# EAGLE design mixer_board_smd (EAGLE 9.4.1)
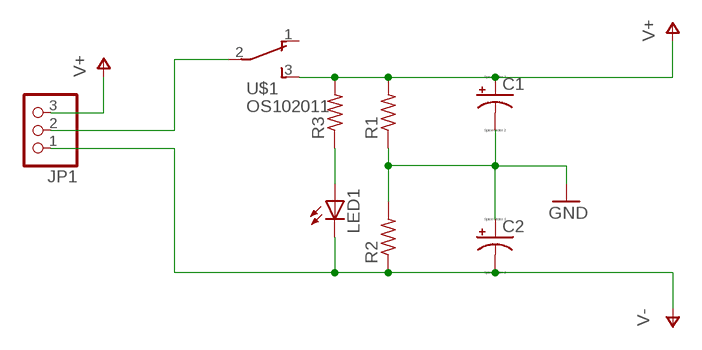
[diagram p0: schematic, sheet 1, part 1 of 2]
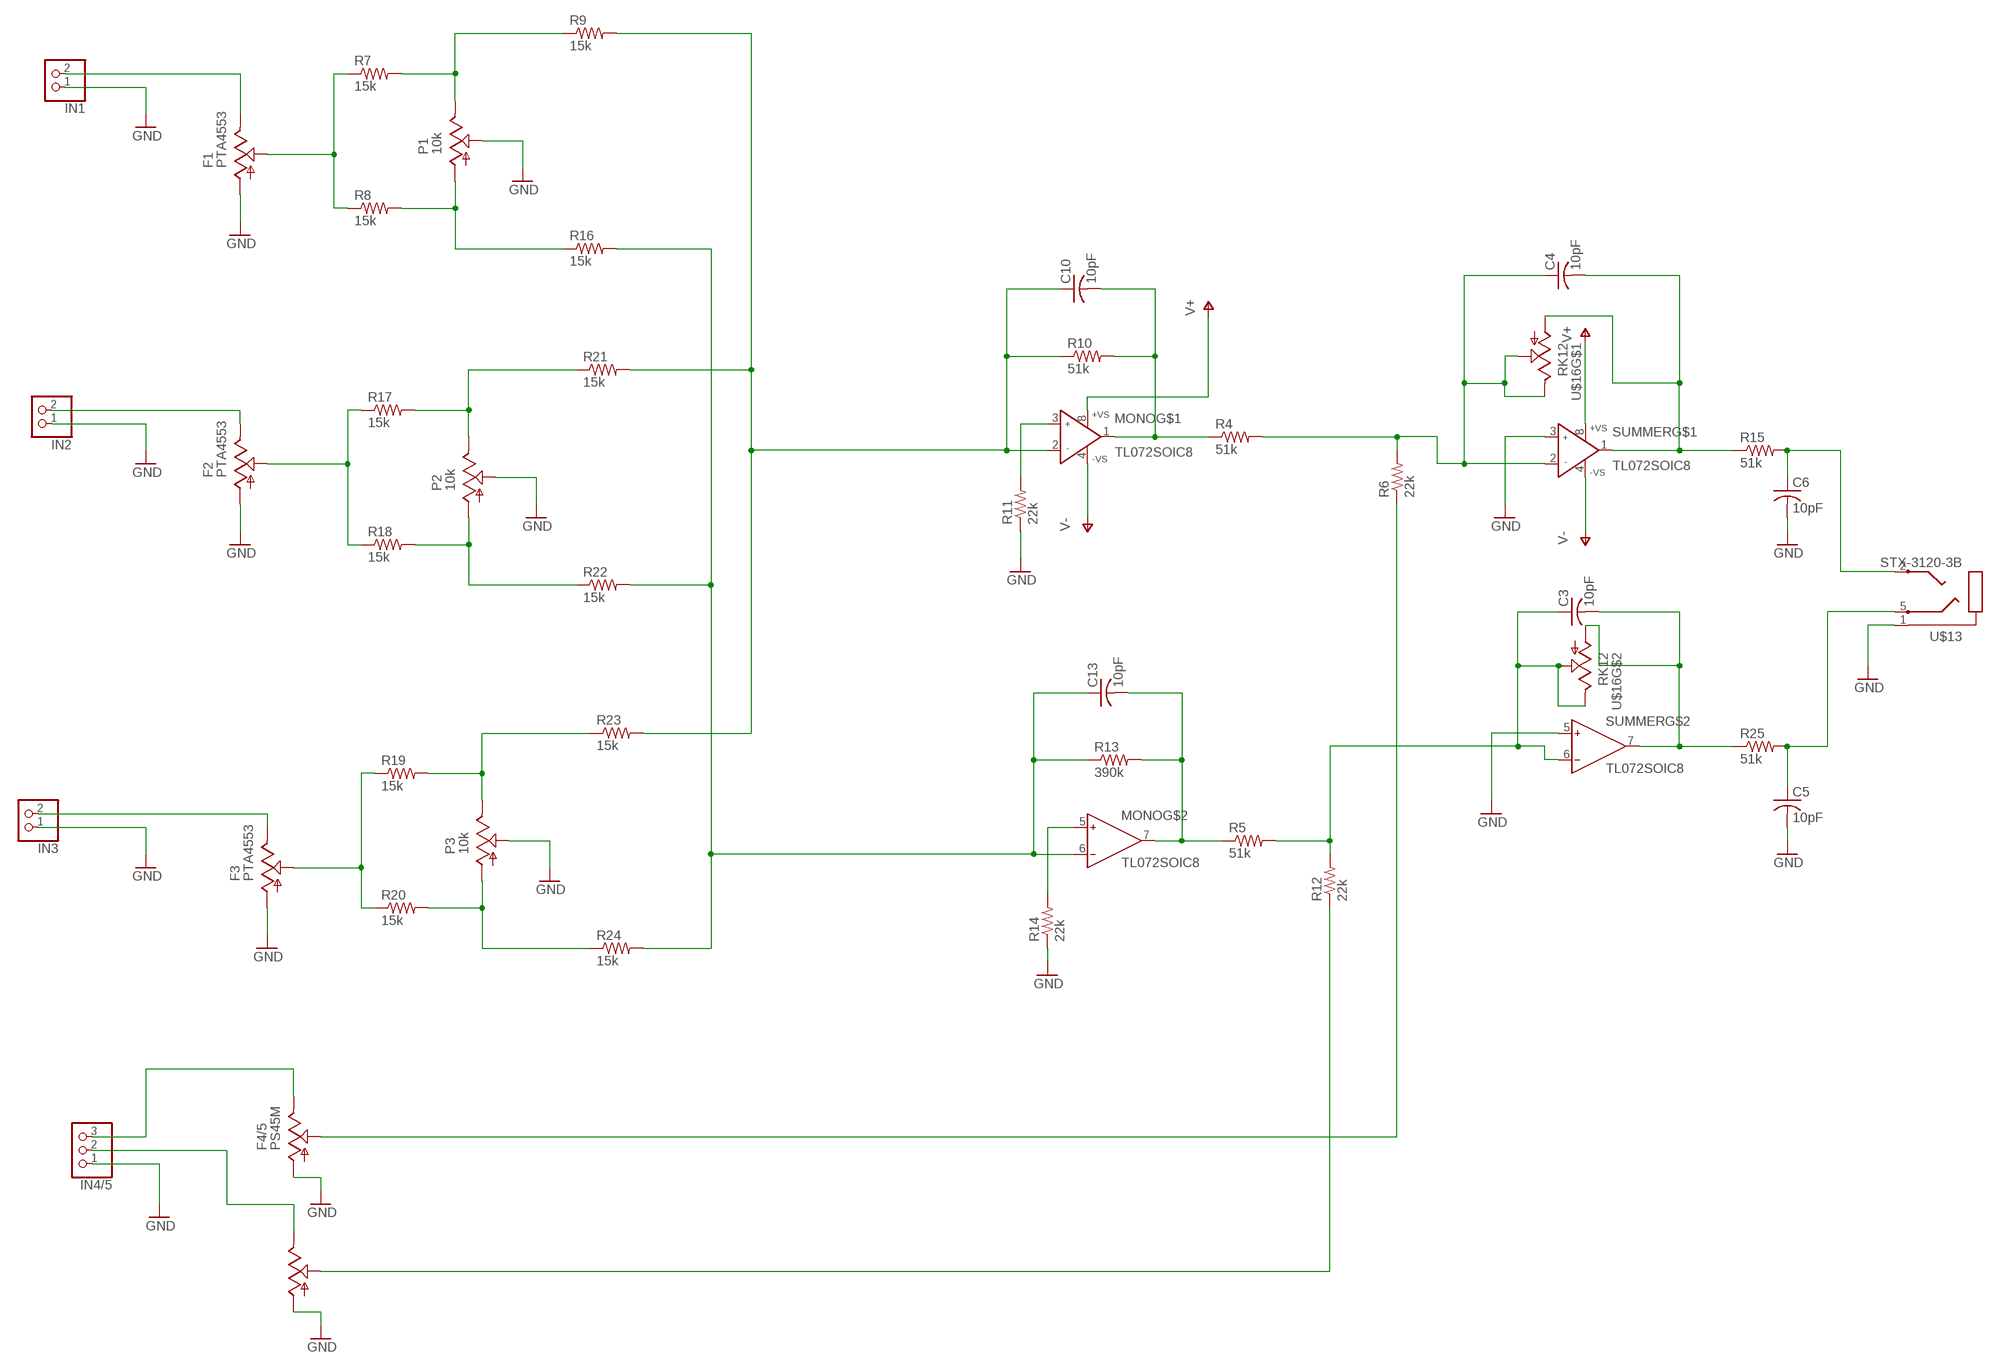
[diagram p1: schematic, sheet 1, part 2 of 2]

## Parts
C1  CPOL-USE1.8-4  [E1,8-4]
C2  CPOL-USE1.8-4  [E1,8-4]
C3  10pF  C-USC0805  [C0805]
C4  10pF  C-USC0805  [C0805]
C5  10pF  C-USC0805  [C0805]
C6  10pF  C-USC0805  [C0805]
C10  10pF  C-USC0805  [C0805]
C13  10pF  C-USC0805  [C0805]
F1  PTA4553  [PTA4553]
F2  PTA4553  [PTA4553]
F3  PTA4553  [PTA4553]
F4/5  PS45M  [PS45M]
IN1  PINHD-1X2/90  [1X02/90]
IN2  PINHD-1X2/90  [1X02/90]
IN3  PINHD-1X2/90  [1X02/90]
IN4/5  PINHD-1X3/90  [1X03/90]
JP1  PINHD-1X3/90  [1X03/90]
LED1  LEDCHIPLED_1206  [CHIPLED_1206]
MONO  TL072SOIC8  [SOIC8]
P1  10k  PTV09A  [PTV09A]
P2  10k  PTV09A  [PTV09A]
P3  10k  PTV09A  [PTV09A]
R1  R-US_M0805  [M0805]
R2  R-US_M0805  [M0805]
R3  R-US_R0805  [R0805]
R4  51k  R-US_M0805  [M0805]
R5  51k  R-US_M0805  [M0805]
R6  22k  R-US_M0805  [M0805]
R7  15k  R-US_M0805  [M0805]
R8  15k  R-US_M0805  [M0805]
R9  15k  R-US_M0805  [M0805]
R10  51k  R-US_M0805  [M0805]
R11  22k  R-US_M0805  [M0805]
R12  22k  R-US_M0805  [M0805]
R13  390k  R-US_M0805  [M0805]
R14  22k  R-US_M0805  [M0805]
R15  51k  R-US_M0805  [M0805]
R16  15k  R-US_M0805  [M0805]
R17  15k  R-US_M0805  [M0805]
R18  15k  R-US_M0805  [M0805]
R19  15k  R-US_M0805  [M0805]
R20  15k  R-US_M0805  [M0805]
R21  15k  R-US_M0805  [M0805]
R22  15k  R-US_M0805  [M0805]
R23  15k  R-US_M0805  [M0805]
R24  15k  R-US_M0805  [M0805]
R25  51k  R-US_M0805  [M0805]
SUMMER  TL072SOIC8  [SOIC8]
U$1  OS102011  [OS102011]
U$13  STX-3120-3B  [STX-3120]
U$16  RK12  [RK12]

## Nets
GND: C1.- C2.+ C5.2 C6.2 F1.1 F2.1 F3.1 F4/5.1 F4/5.1' IN1.1 IN2.1 IN3.1 IN4/5.1 P1.2 P2.2 P3.2 R1.1 R2.2 R11.1 R14.1 SUMMER.3(IN+) SUMMER.5(IN+) U$13.1
N$1: JP1.2 U$1.2(P)
N$2: LED1.A R3.1
N$5: F4/5.3 IN4/5.3
N$6: F4/5.3' IN4/5.2
N$7: C4.2 R15.1 SUMMER.1(OUT) U$16.1
N$14: F1.2 R7.1 R8.1
N$15: F4/5.2 R6.1
N$16: P1.3 R7.2 R9.1
N$17: P1.1 R8.2 R16.1
N$18: C10.1 MONO.2(IN-) R9.2 R10.1 R21.2 R23.2
N$19: C10.2 MONO.1(OUT) R4.1 R10.2
N$20: C6.1 R15.2 U$13.2
N$21: C4.1 R4.2 R6.2 SUMMER.2(IN-) U$16.2 U$16.3
N$22: MONO.3(IN+) R11.2
N$23: P2.3 R17.2 R21.1
N$24: C13.2 MONO.7(OUT) R5.1 R13.2
N$25: C5.1 R25.2 U$13.5
N$26: MONO.5(IN+) R14.2
N$27: F4/5.2' R12.1
N$29: C3.2 R25.1 SUMMER.7(OUT) U$16.1'
N$30: C13.1 MONO.6(IN-) R13.1 R16.2 R22.2 R24.2
N$31: P2.1 R18.2 R22.1
N$33: C3.1 R5.2 R12.2 SUMMER.6(IN-) U$16.2' U$16.3'
N$35: P3.3 R19.2 R23.1
N$36: P3.1 R20.2 R24.1
N$37: F1.3 IN1.2
N$38: F2.3 IN2.2
N$39: F2.2 R17.1 R18.1
N$42: F3.2 R19.1 R20.1
N$46: F3.3 IN3.2
V+: C1.+ JP1.3 MONO.8(+VS) R1.2 R3.2 SUMMER.8(+VS) U$1.3(S)
V-: C2.- JP1.1 LED1.C MONO.4(-VS) R2.1 SUMMER.4(-VS)
Unconnected: U$1.1(O)

## Library data of the parts
C1 C2 = resistor:CPOL-US: POLARIZED CAPACITOR, American symbol
C3-C6 C10 C13 = resistor:C-US: CAPACITOR, American symbol
F1-F3 = biblib:PTA4553
F4/5 = biblib:PS45M
IN1-IN3 = pinhead:PINHD-1X2: PIN HEADER
IN4/5 JP1 = pinhead:PINHD-1X3: PIN HEADER
LED1 = led:LED: LED OSRAM: - CHIPLED LG R971, LG N971, LY N971, LG Q971, LY Q971, LO R971, LY R971 LH N974, LH R974 LS Q976, LO Q976, LY Q976 LO Q996 - Hyper CHIPLED LW Q18S LB Q993, LB Q99A, LB R99A - SideLED LS A670, LO A670, LY A670, LG A670, LP A670 LB A673, LV A673, LT A673, LW A673 LH A674 LY A675 LS A676, LA A676, LO A676, LY A676, LW A676 LS A679, LY A679, LG A679 - Hyper Micro SIDELED® LS Y876, LA Y876, LO Y876, LY Y876 LT Y87S - SmartLED LW L88C, LW L88S LB L89C, LB L89S, LG L890 LS L89K, LO L89K, LY L89K LS L896, LA L896, LO L896, LY L896 - TOPLED LS T670, LO T670, LY T670, LG T670, LP T670 LSG T670, LSP T670, LSY T670, LOP T670, LYG T670 LG T671, LOG T671, LSG T671 LB T673, LV T673, LT T673, LW T673 LH T674 LS T676, LA T676, LO T676, LY T676, LB T676, LH T676, LSB T676, LW T676 LB T67C, LV T67C, LT T67C, LS T67K, LO T67K, LY T67K, LW E67C LS E67B, LA E67B, LO E67B, LY E67B, LB E67C, LV E67C, LT E67C LW T67C LS T679, LY T679, LG T679 LS T770, LO T770, LY T770, LG T770, LP T770 LB T773, LV T773, LT T773, LW T773 LH T774 LS E675, LA E675, LY E675, LS T675 LS T776, LA T776, LO T776, LY T776, LB T776 LHGB T686 LT T68C, LB T68C - Hyper Mini TOPLED® LB M676 - Mini TOPLED Santana® LG M470 LS M47K, LO M47K, LY M47K Source: http://www.osram.convergy.de LUXEON: - LUMILED® LXK2-PW12-R00, LXK2-PW12-S00, LXK2-PW14-U00, LXK2-PW14-V00 LXK2-PM12-R00, LXK2-PM12-S00, LXK2-PM14-U00 LXK2-PE12-Q00, LXK2-PE12-R00, LXK2-PE12-S00, LXK2-PE14-T00, LXK2-PE14-U00 LXK2-PB12-K00, LXK2-PB12-L00, LXK2-PB12-M00, LXK2-PB14-N00, LXK2-PB14-P00, LXK2-PB14-Q00 LXK2-PR12-L00, LXK2-PR12-M00, LXK2-PR14-Q00, LXK2-PR14-R00 LXK2-PD12-Q00, LXK2-PD12-R00, LXK2-PD12-S00 LXK2-PH12-R00, LXK2-PH12-S00 LXK2-PL12-P00, LXK2-PL12-Q00, LXK2-PL12-R00 Source: www.luxeon.com KINGBRIGHT: KA-3528ASYC Source: www.kingbright.com
MONO SUMMER = biblib:TL072
P1-P3 = biblib:PTV09A
R1-R25 = resistor:R-US_: RESISTOR, American symbol
U$1 = biblib:OS102011
U$13 = biblib:STX-3120-3B
U$16 = biblib:RK12

## Board
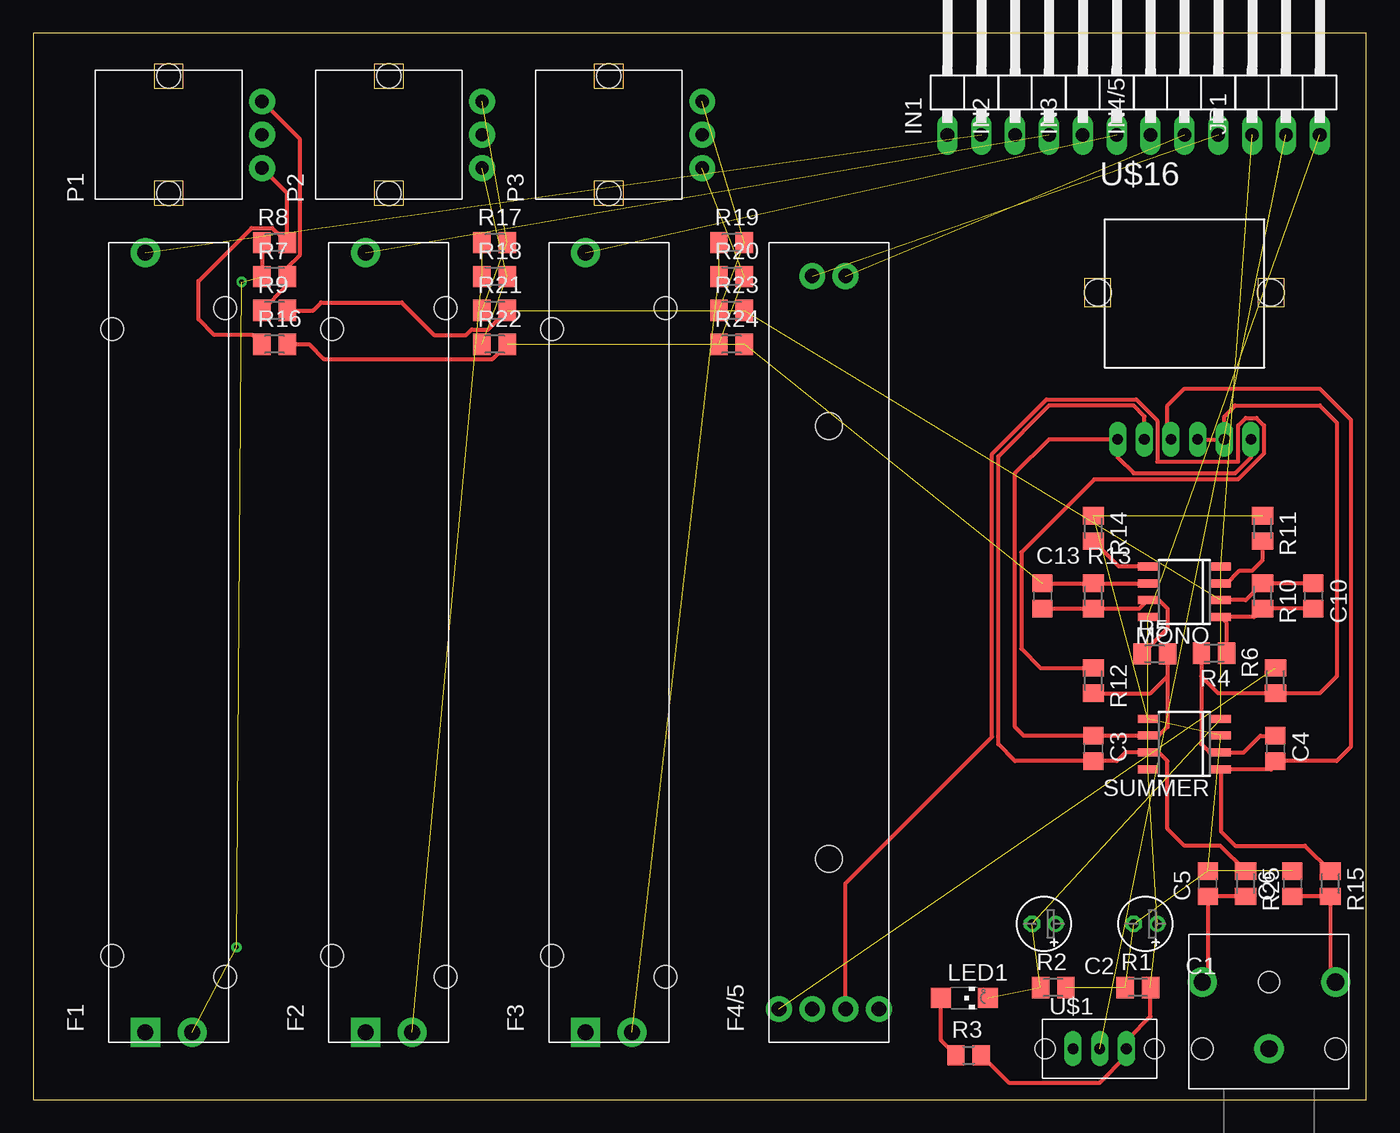
[diagram p2: board, top side]
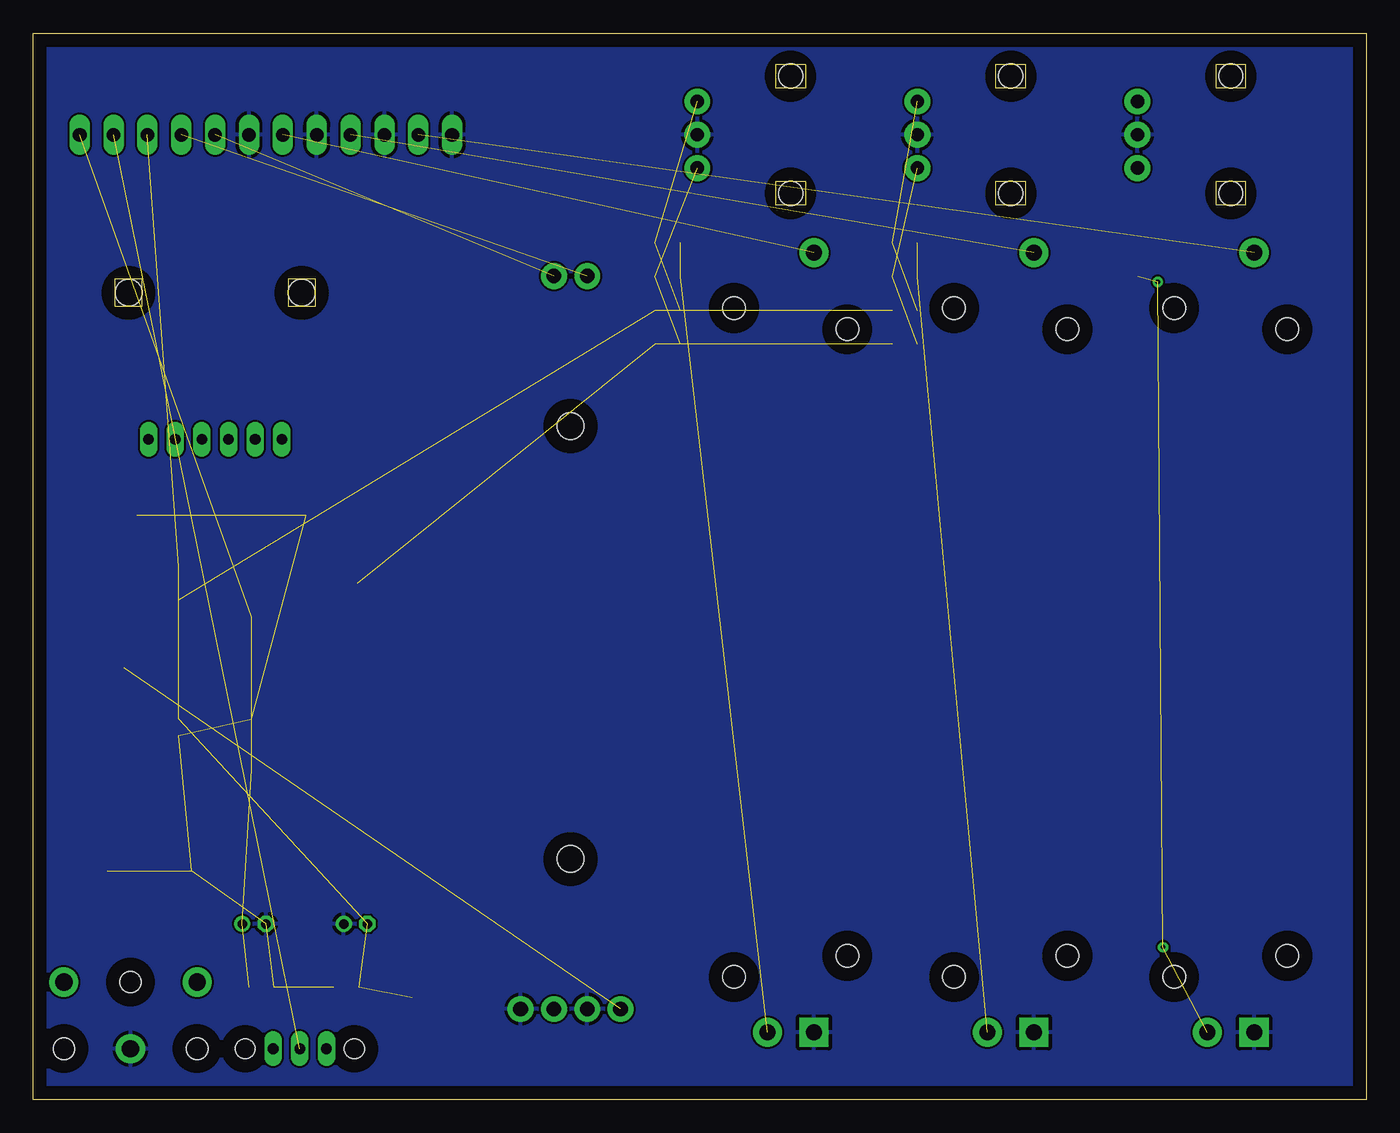
[diagram p3: board, bottom side, seen from below]

Size 100 x 80 mm. Coordinates in mm from the lower left corner, seen from the top.
Outline: 0,0 100,0 100,80 0,80 0,0
Copper layers (1*16): Top 0.035mm / dielectric 1.5mm / Bottom 0.035mm
Design rules "default *": minimum track width 10mil, minimum drill 0.35mm, track to track 6mil, track to pad 6mil, pad to pad 6mil, via to via 6mil, smd to smd 6mil, copper to edge 40mil, drill to drill 6mil, minimum pad ring 10mil, minimum via ring 8mil, stop-mask expansion 4mil, vias tented up to drill 0mil, thermal gap 10mil

### Footprints (pad centres in the part's own frame; a part is rotated, then mirrored left to right if it is on the bottom)
E1,8-4 = drill 0.711 pad 1.168: + -0.889,0 | drill 0.711 pad 1.168 octagon: - 0.889,0
C0805 = smd 1.3 x 1.5: 1 -0.95,0; 2 0.95,0
PTA4553 = drill 1.2 pad 2.184 square: 1 -29.25,1.75 | drill 1.2 pad 2.184: 2 -29.25,-1.75; 3 29.25,1.75 | hole 1.7: -23.5,4.25; 23.5,4.25; -25.1,-4.25; 25.1,-4.25
PS45M = drill 1.1 pad 1.93: 1 -27.5,1.25; 1' -27.5,-3.75; 2 -27.5,3.75; 2' -27.5,-1.25; 3 27.5,1.25; 3' 27.5,-1.25 | hole 2: -16.25,0; 16.25,0
1X02/90 = drill 1.016 long: 1 -1.27,-3.81; 2 1.27,-3.81
1X03/90 = drill 1.016 long: 1 -2.54,-3.81; 2 0,-3.81; 3 2.54,-3.81
CHIPLED_1206 = smd 1.5 x 1.5: A 0,-1.75; C 0,1.75
SOIC8 = smd 0.6 x 1.5: 1 -1.905,-2.75; 2 -0.635,-2.75; 3 0.635,-2.75; 4 1.905,-2.75; 5 1.905,2.75; 6 0.635,2.75; 7 -0.635,2.75; 8 -1.905,2.75
PTV09A = drill 1 pad 1.93: 1 -2.5,-7; 2 0,-7; 3 2.5,-7 | hole 1.8: -4.4,0; 4.4,0
M0805 = smd 1.3 x 1.6: 1 -0.95,0; 2 0.95,0
R0805 = smd 1.3 x 1.5: 1 -0.95,0; 2 0.95,0
OS102011 = drill 0.8 long: 1 -2,0; 2 0,0; 3 2,0 | hole 1.5: -4.1,0; 4.1,0
STX-3120 = drill 1.3 pad 2.184: 1 0,0; 2 5,-5; 5 5,5 | hole 1.6: 0,5; 0,-5; 5,0
RK12 = drill 0.8 long: 1 -1,0; 1' -3,0; 2 1,0; 2' -5,0; 3 3,0; 3' 5,0 | hole 2: -6.5,11; 6.5,11

### Placement (x,y rotation side)
C1  83.44,13.18 180 top
C2  75.82,13.18 180 top
C3  79.53,26.35 270 top
C4  93.19,26.35 270 top
C5  88.11,16.2 90 top
C6  94.46,16.2 90 top
C10  96.04,37.78 270 top
C13  75.72,37.78 270 top
F1  10.16,34.29 90 top
F2  26.67,34.29 90 top
F3  43.18,34.29 90 top
F4/5  59.69,34.29 90 top
IN1  69.85,76.2 0 top
IN2  74.93,76.2 0 top
IN3  80.01,76.2 0 top
IN4/5  86.36,76.2 0 top
JP1  93.98,76.2 0 top
LED1  69.85,7.62 270 top
MONO  86.36,38.1 90 top
P1  10.16,72.39 90 top
P2  26.67,72.39 90 top
P3  43.18,72.39 90 top
R1  82.87,8.41 0 top
R2  76.52,8.41 0 top
R3  70.17,3.33 0 top
R4  88.58,33.5 180 top
R5  84.14,33.43 0 top
R6  93.19,31.43 270 top
R7  18.1,61.75 0 top
R8  18.1,64.29 0 top
R9  18.1,59.21 0 top
R10  92.23,37.78 270 top
R11  92.23,42.86 270 top
R12  79.53,31.43 270 top
R13  79.53,37.78 270 top
R14  79.53,42.86 270 top
R15  97.31,16.19 270 top
R16  18.1,56.67 0 top
R17  34.61,64.29 0 top
R18  34.61,61.75 0 top
R19  52.39,64.29 0 top
R20  52.39,61.75 0 top
R21  34.61,59.21 0 top
R22  34.61,56.67 0 top
R23  52.39,59.21 0 top
R24  52.39,56.67 0 top
R25  90.96,16.19 270 top
SUMMER  86.36,26.67 90 top
U$1  80.01,3.81 0 top
U$13  92.71,3.81 90 top
U$16  86.36,49.53 0 top

### Tracks (layer width: path | path; a pad name or v marks a point on that pad's centre or on a via)
GND  (8 unrouted)
  pour Bottom: 0,80.01 0,0 100.33,0 100.33,80.01
N$1  (1 unrouted)
N$2
  Top 0.305: R3.1 68.1,4.45 LED1.A
N$5  (1 unrouted)
N$6  (1 unrouted)
N$7
  Top 0.305: R15.1 95.4,19.05 90.17,19.05 89.11,20.11 SUMMER.1 92.86,24.77 C4.2 97.79,25.4 98.83,26.44 98.83,51.03 96.52,53.34 86.36,53.34 85.09,52.07 85.09,49.8 U$16.1
N$14  (via drill 0.35)  (3 unrouted)
  Top 0.305: R8.1 R7.1
  Bottom 0.305: v15.24,11.43
  other vias: 15.63,61.35
N$15  (1 unrouted)
N$16
  Top 0.305: R9.1 19.05,61.11 R7.2 19.05,62.41 20,63.36 20,72.05 P1.3
N$17
  Top 0.305: R8.2 19.05,64.77 | 19.05,64.77 19.05,68 P1.1 | 19.05,64.77 18.55,64.77 17.93,65.39 16.37,65.39 12.39,61.41 12.39,58.55 13.57,57.37 16.45,57.37 R16.1
N$18  (2 unrouted)
  Top 0.305: R9.2 20.99,59.21 21.58,59.81 27.65,59.81 30.08,57.37 32.48,57.37 32.88,57.77 34.12,57.77 R21.2 | MONO.2 90.97,37.47 R10.1 C10.1
N$19
  Top 0.305: C10.2 R10.2 91.59,36.2 MONO.1 89.53,35.77 R4.1
N$20
  Top 0.305: C6.1 R15.2 97.31,9.21 U$13.2
N$21
  Top 0.305: R4.2 87.63,31.75 | 87.63,31.75 87.63,26.67 88.27,26.04 SUMMER.2 90.81,26.04 92.07,27.3 C4.1 | 87.63,31.75 88.9,30.48 R6.2 96.52,30.48 97.79,31.75 97.79,50.8 96.52,52.07 90.17,52.07 89.36,51.26 U$16.3 U$16.2
N$22
  Top 0.305: MONO.3 89.53,38.73 90.48,39.69 91.44,39.69 92.23,40.48 R11.2
N$23  (2 unrouted)
N$24
  Top 0.305: C13.2 R13.2 82.97,36.83 MONO.7 84.45,37.47 85.09,36.83 85.09,35.33 R5.1
N$25
  Top 0.305: R25.2 C5.1 88.11,9.21 U$13.5
N$26
  Top 0.305: MONO.5 81.44,40.01 R14.2
N$27
  Top 0.305: F4/5.2' 60.94,16.22 71.93,27.22 71.93,48.45 76.01,52.53 82.74,52.53 84.32,50.95 84.32,47.87 90.4,47.87 90.4,50.58 90.96,51.14 91.76,51.14 92.32,50.58 92.32,48.48 90.37,46.53 79.59,46.53 74.12,41.06 74.12,33.83 75.57,32.38 R12.1
N$29
  Top 0.305: R25.1 89.05,19.05 86.36,19.05 85.09,20.32 85.09,25.4 84.45,26.04 SUMMER.7 81.92,26.04 81.28,25.4 C3.2 73.66,25.4 72.39,26.67 72.39,48.26 76.2,52.07 82.55,52.07 83.36,51.26 U$16.1'
N$30  (2 unrouted)
  Top 0.305: R16.2 20.69,56.67 21.79,55.56 34.45,55.56 R22.2 | MONO.6 R13.1 C13.1
N$31  (2 unrouted)
N$33
  Top 0.305: SUMMER.6 C3.1 74.3,27.3 73.66,27.94 73.66,46.99 76.2,49.53 U$16.2' 81.36,48.18 82.55,46.99 90.17,46.99 91.36,48.18 U$16.3' | R5.2 85.09,31.75 | 85.09,31.75 85.09,27.94 84.45,27.3 SUMMER.6 | R12.2 83.82,30.48 85.09,31.75 | 83.19,27.3 SUMMER.6
N$35  (2 unrouted)
N$36  (2 unrouted)
N$37  (1 unrouted)
N$38  (1 unrouted)
N$39  (2 unrouted)
N$42  (2 unrouted)
N$46  (1 unrouted)
V+  (4 unrouted)
  Top 0.305: R1.2 83.82,6.23 82.19,4.61 82.19,3.99 U$1.3 82.01,3.27 80.01,1.27 73.18,1.27 R3.2
V-  (5 unrouted)